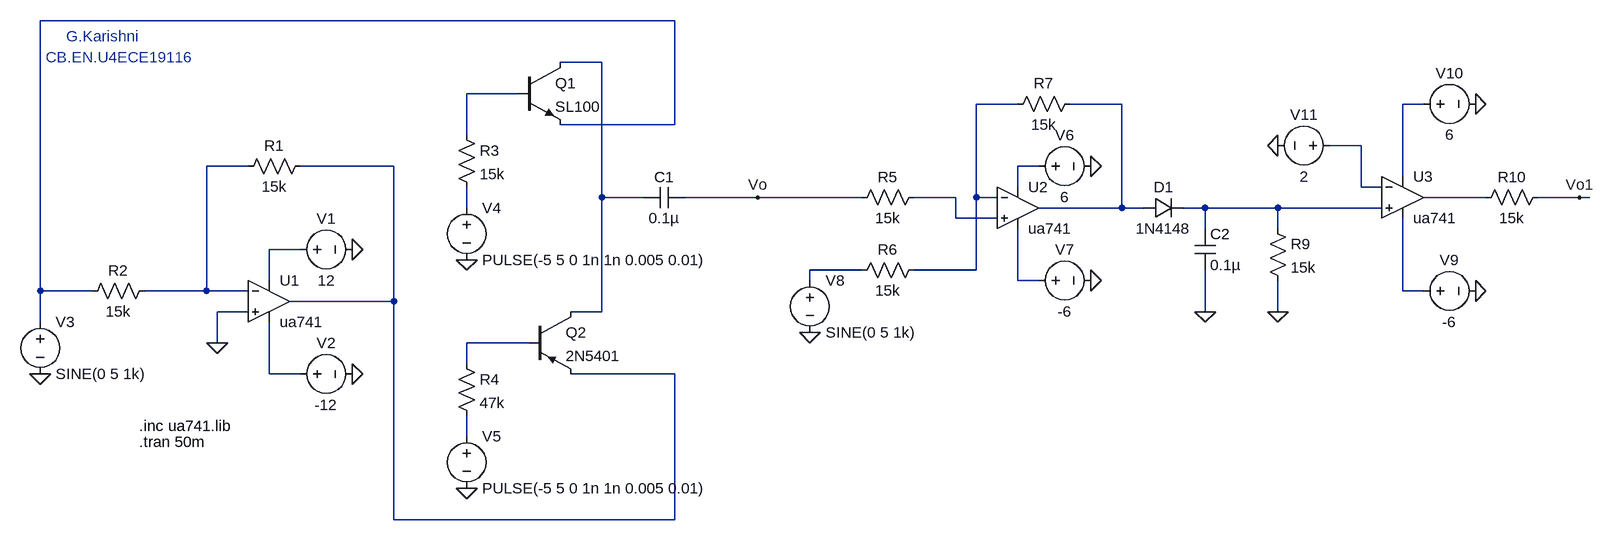
[diagram p0: schematic Draft_demodulation.asc]
Draft_demodulation.asc, the LTspice schematic file:
Version 4
SHEET 1 2200 680
WIRE 768 -272 -208 -272
WIRE 656 -208 592 -208
WIRE 528 -160 448 -160
WIRE 1296 -144 1232 -144
WIRE 1456 -144 1376 -144
WIRE 1920 -144 1888 -144
WIRE 768 -112 768 -272
WIRE 768 -112 592 -112
WIRE 448 -96 448 -160
WIRE 1824 -80 1776 -80
WIRE 112 -48 48 -48
WIRE 336 -48 192 -48
WIRE 1328 -48 1296 -48
WIRE 1888 -32 1888 -144
WIRE 1296 -16 1296 -48
WIRE 1824 -16 1824 -80
WIRE 1856 -16 1824 -16
WIRE 656 0 656 -208
WIRE 720 0 656 0
WIRE 896 0 784 0
WIRE 1056 0 896 0
WIRE 1200 0 1136 0
WIRE 1232 0 1232 -144
WIRE 1264 0 1232 0
WIRE 2016 0 1920 0
WIRE 2160 0 2096 0
WIRE 2176 0 2160 0
WIRE 448 16 448 -16
WIRE 1456 16 1456 -144
WIRE 1456 16 1328 16
WIRE 1488 16 1456 16
WIRE 1584 16 1552 16
WIRE 1696 16 1584 16
WIRE 1856 16 1696 16
WIRE 1200 32 1200 0
WIRE 1264 32 1200 32
WIRE 1584 48 1584 16
WIRE 1696 48 1696 16
WIRE 192 80 144 80
WIRE 1056 112 976 112
WIRE 1232 112 1232 0
WIRE 1232 112 1136 112
WIRE 144 128 144 80
WIRE 976 128 976 112
WIRE 1296 128 1296 48
WIRE 1328 128 1296 128
WIRE -208 144 -208 -272
WIRE -128 144 -208 144
WIRE 48 144 48 -48
WIRE 48 144 -48 144
WIRE 112 144 48 144
WIRE 1888 144 1888 32
WIRE 1920 144 1888 144
WIRE 336 160 336 -48
WIRE 336 160 176 160
WIRE 112 176 64 176
WIRE 656 176 656 0
WIRE 656 176 608 176
WIRE 1584 176 1584 112
WIRE 1696 176 1696 128
WIRE -208 192 -208 144
WIRE 64 224 64 176
WIRE 544 224 448 224
WIRE 448 256 448 224
WIRE 144 272 144 192
WIRE 192 272 144 272
WIRE 768 272 608 272
WIRE 448 368 448 336
WIRE 336 496 336 160
WIRE 768 496 768 272
WIRE 768 496 336 496
FLAG 272 80 0
FLAG 272 272 0
FLAG 64 224 0
FLAG -208 272 0
FLAG 448 96 0
FLAG 448 448 0
FLAG 896 0 Vo
FLAG 1408 -48 0
FLAG 1408 128 0
FLAG 976 208 0
FLAG 1584 176 0
FLAG 1696 176 0
FLAG 2000 -144 0
FLAG 2000 144 0
FLAG 1696 -80 0
FLAG 2160 0 Vo1
SYMBOL OpAmps\\ua741 144 96 R0
SYMATTR InstName U1
SYMBOL voltage 176 80 R270
WINDOW 0 32 56 VTop 2
WINDOW 3 -32 56 VBottom 2
WINDOW 123 0 0 Left 0
WINDOW 39 0 0 Left 0
SYMATTR InstName V1
SYMATTR Value 12
SYMBOL voltage 176 272 R270
WINDOW 0 32 56 VTop 2
WINDOW 3 -32 56 VBottom 2
WINDOW 123 0 0 Left 0
WINDOW 39 0 0 Left 0
SYMATTR InstName V2
SYMATTR Value -12
SYMBOL res 208 -64 R90
WINDOW 0 0 56 VBottom 2
WINDOW 3 32 56 VTop 2
SYMATTR InstName R1
SYMATTR Value 15k
SYMBOL res -32 128 R90
WINDOW 0 0 56 VBottom 2
WINDOW 3 32 56 VTop 2
SYMATTR InstName R2
SYMATTR Value 15k
SYMBOL voltage -208 176 R0
WINDOW 123 0 0 Left 0
WINDOW 39 0 0 Left 0
SYMATTR InstName V3
SYMATTR Value SINE(0 5 1k)
SYMBOL npn 528 -208 R0
SYMATTR InstName Q1
SYMATTR Value SL100
SYMBOL res 432 -112 R0
SYMATTR InstName R3
SYMATTR Value 15k
SYMBOL voltage 448 0 R0
WINDOW 123 0 0 Left 0
WINDOW 39 0 0 Left 0
SYMATTR InstName V4
SYMATTR Value PULSE(-5 5 0 1n 1n 0.005 0.01)
SYMBOL pnp 544 176 R0
SYMATTR InstName Q2
SYMATTR Value 2N5401
SYMBOL res 432 240 R0
SYMATTR InstName R4
SYMATTR Value 47k
SYMBOL voltage 448 352 R0
WINDOW 123 0 0 Left 0
WINDOW 39 0 0 Left 0
SYMATTR InstName V5
SYMATTR Value PULSE(-5 5 0 1n 1n 0.005 0.01)
SYMBOL cap 784 -16 R90
WINDOW 0 0 32 VBottom 2
WINDOW 3 32 32 VTop 2
SYMATTR InstName C1
SYMATTR Value 0.1µ
SYMBOL res 1152 -16 R90
WINDOW 0 0 56 VBottom 2
WINDOW 3 32 56 VTop 2
SYMATTR InstName R5
SYMATTR Value 15k
SYMBOL res 1152 96 R90
WINDOW 0 0 56 VBottom 2
WINDOW 3 32 56 VTop 2
SYMATTR InstName R6
SYMATTR Value 15k
SYMBOL res 1392 -160 R90
WINDOW 0 0 56 VBottom 2
WINDOW 3 32 56 VTop 2
SYMATTR InstName R7
SYMATTR Value 15k
SYMBOL OpAmps\\ua741 1296 -48 R0
SYMATTR InstName U2
SYMBOL voltage 1312 -48 R270
WINDOW 0 32 56 VTop 2
WINDOW 3 -32 56 VBottom 2
WINDOW 123 0 0 Left 0
WINDOW 39 0 0 Left 0
SYMATTR InstName V6
SYMATTR Value 6
SYMBOL voltage 1312 128 R270
WINDOW 0 32 56 VTop 2
WINDOW 3 -32 56 VBottom 2
WINDOW 123 0 0 Left 0
WINDOW 39 0 0 Left 0
SYMATTR InstName V7
SYMATTR Value -6
SYMBOL voltage 976 112 R0
WINDOW 123 0 0 Left 0
WINDOW 39 0 0 Left 0
SYMATTR InstName V8
SYMATTR Value SINE(0 5 1k)
SYMBOL diode 1488 32 R270
WINDOW 0 32 32 VTop 2
WINDOW 3 0 32 VBottom 2
SYMATTR InstName D1
SYMATTR Value 1N4148
SYMBOL cap 1568 48 R0
SYMATTR InstName C2
SYMATTR Value 0.1µ
SYMBOL res 1680 32 R0
SYMATTR InstName R9
SYMATTR Value 15k
SYMBOL OpAmps\\ua741 1888 -64 R0
SYMATTR InstName U3
SYMBOL res 2112 -16 R90
WINDOW 0 0 56 VBottom 2
WINDOW 3 32 56 VTop 2
SYMATTR InstName R10
SYMATTR Value 15k
SYMBOL voltage 1904 144 R270
WINDOW 0 32 56 VTop 2
WINDOW 3 -32 56 VBottom 2
WINDOW 123 0 0 Left 0
WINDOW 39 0 0 Left 0
SYMATTR InstName V9
SYMATTR Value -6
SYMBOL voltage 1904 -144 R270
WINDOW 0 32 56 VTop 2
WINDOW 3 -32 56 VBottom 2
WINDOW 123 0 0 Left 0
WINDOW 39 0 0 Left 0
SYMATTR InstName V10
SYMATTR Value 6
SYMBOL voltage 1792 -80 R90
WINDOW 0 -32 56 VBottom 2
WINDOW 3 32 56 VTop 2
WINDOW 123 0 0 Left 0
WINDOW 39 0 0 Left 0
SYMATTR InstName V11
SYMATTR Value 2
TEXT -56 352 Left 2 !.inc ua741.lib
TEXT -56 376 Left 2 !.tran 50m
TEXT -168 -248 Left 2 ;G.Karishni
TEXT -200 -216 Left 2 ;CB.EN.U4ECE19116

The netlist it stands for:
* Draft_demodulation.asc
XU1 0 N008 N015 N020 N009 ua741  ; pins In+ In- V+ V- OUT
V1 N015 0 12
V2 N020 0 -12
R1 N009 N008 15k
R2 N008 N001 15k
V3 N001 0 SINE(0 5 1k)
Q1 N002 N003 N001 0 SL100
R3 N003 N013 15k
V4 N013 0 PULSE(-5 5 0 1n 1n 0.005 0.01)
Q2 N002 N019 N009 0 2N5401
R4 N019 N021 47k
V5 N021 0 PULSE(-5 5 0 1n 1n 0.005 0.01)
C1 Vo N002 0.1µ
R5 N011 Vo 15k
R6 N004 N016 15k
R7 N005 N004 15k
XU2 N011 N004 N010 N017 N005 ua741  ; pins In+ In- V+ V- OUT
V6 N010 0 6
V7 N017 0 -6
V8 N016 0 SINE(0 5 1k)
D1 N005 N014 1N4148
C2 N014 0 0.1µ
R9 N014 0 15k
XU3 N014 N007 N006 N018 N012 ua741  ; pins In+ In- V+ V- OUT
R10 Vo1 N012 15k
V9 N018 0 -6
V10 N006 0 6
V11 N007 0 2
.model D D
.lib standard.dio
.model NPN NPN
.model PNP PNP
.lib standard.bjt
.inc ua741.lib
.tran 50m
* G.Karishni
* CB.EN.U4ECE19116
.backanno
.end